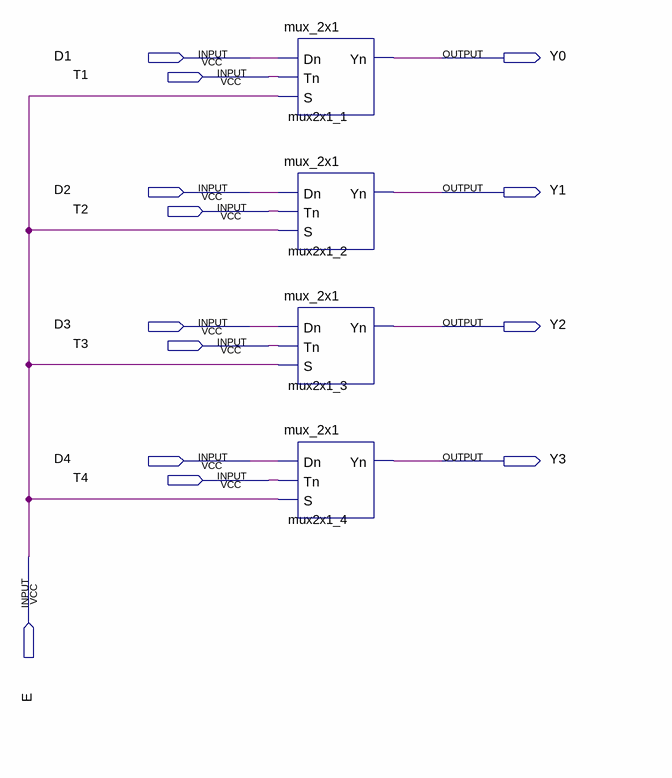
[diagram p0: schematic sheet]
// Quartus schematic conv_seletor.bdf as structural Verilog: 4 symbols, 13 pins
module conv_seletor (
  input  D1,
  input  T1,
  input  D2,
  input  T2,
  input  D3,
  input  T3,
  input  D4,
  input  T4,
  input  E,
  output Y0,
  output Y1,
  output Y2,
  output Y3
);

  mux_2x1 mux2x1_1 (.Dn(D1), .Tn(T1), .S(E), .Yn(Y0));
  mux_2x1 mux2x1_2 (.Dn(D2), .Tn(T2), .S(E), .Yn(Y1));
  mux_2x1 mux2x1_3 (.Dn(D3), .Tn(T3), .S(E), .Yn(Y2));
  mux_2x1 mux2x1_4 (.Dn(D4), .Tn(T4), .S(E), .Yn(Y3));
endmodule
